# Altium schematic sheet [6] RGBLED.SchDoc: =DocumentName
size A3; ENG_APP_DATE: --/--/--; DSN_APP_DATE: --/--/--; CHK_APP_DATE: --/--/--; Organization: ORGANIZATION; Address1: R. Aprígio Veloso, 882, Universitário; Address2: Campina Grande - PB; Address3: 58429-900; DocumentNumber: 6; Revision: -; SheetNumber: 6; SheetTotal: 9; ENG_DATE: --/--/--; DSN_DATE: --/--/--; CHK_DATE: --/--/--; SCH_SCALE: 1:1
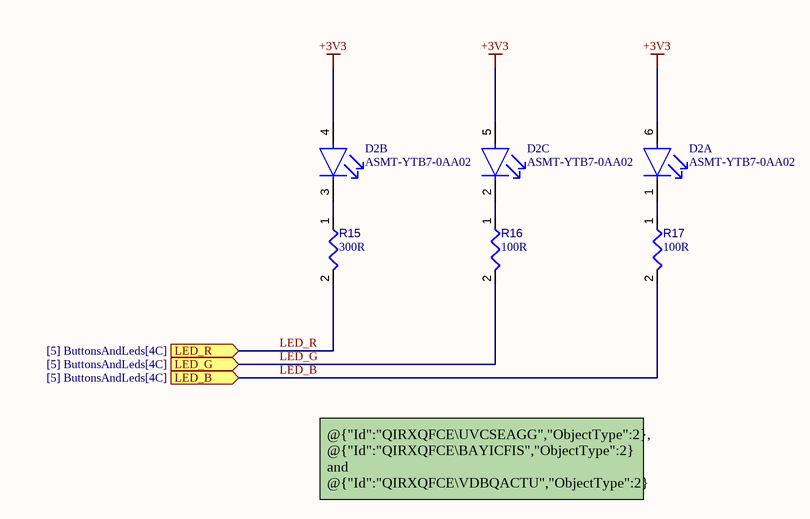
[diagram p0: [6] RGBLED.SchDoc]

## Parts
D2  ASMT-YTB7-0AA02  [FP-PLCC-6-MFG]  (parts A,B,C of 3)
R15  value 300R  [RESC0603(1608)_L]  (hidden comment: ERJ-3GEYJ301V)
R16  value 100R  [RESC0603(1608)_L]  (hidden comment: ERJ-3EKF1000V)
R17  value 100R  [RESC0603(1608)_L]  (hidden comment: ERJ-3EKF1000V)

## Ports
LED_B (in, see [5] ButtonsAndLeds[4C]), LED_G (in, see [5] ButtonsAndLeds[4C]), LED_R (in, see [5] ButtonsAndLeds[4C])

## Nets
+3V3: D2.4(Anode(Red)) D2.5(Anode(Green)) D2.6(Anode(Blue))
LED_B: R17.2 ; port LED_B
LED_G: R16.2 ; port LED_G
LED_R: R15.2 ; port LED_R
NetD2_1: D2.1(Cathode(Blue)) R17.1
NetD2_2: D2.2(Cathode(Green)) R16.1
NetD2_3: D2.3(Cathode(Red)) R15.1

## Notes on the sheet
- @{"Id":"QIRXQFCE\UVCSEAGG","ObjectType":2}, @{"Id":"QIRXQFCE\BAYICFIS","ObjectType":2} and @{"Id":"QIRXQFCE\VDBQACTU","ObjectType":2} calculated based on voltage drops for each LED for a same current amount of 10mA.
- REVISION
- DESCRIPTION
- DATE
- APPROVED
- ADDRESS
- PROJECT
- VERSION
- TITLE
- A3
- SIZE
- SCALE
- DOCUMENT NAME:
- DOCUMENT REVISION:
- OF
- SHEET:
- PROJECT REVISION:

## Library data of the parts
D2 = CMP-007-00036-1: LED Tri-Color Blue/Green/Red 469nm/529nm/623nm Chip LED 6-Pin PLCC T/R; Forward Voltage: 3.1V; Test Current: 20mA; Number of LEDs: 3; Lens Transparency: Diffused; Luminous Intensity: 384mcd; Viewing Angle: 120°; Color: Blue,Green,Red; Reverse Voltage: 4V; Dominant Wavelength: 469nm; Lens Style: Flat,Square,Diffused,Rectangular; Lens Size: 2.3mm; Packaging: Cut Tape; Min Operating Temperature: -40°C; Weight: 40mg; Forward Current: 20mA; Orientation: Top View; Package Quantity: 2000; Case/Package: PLCC; Length: 3mm; Height: 2mm; Max Operating Temperature: 100°C; Contact Plating: Silver; Width: 2.8mm; Reach SVHC Compliant: No; Pins: 6; Series: -; Mounting Technology: Surface Mount
R15 = CMP-009-00189-1: Res Thick Film 0603 300 Ohm 5% 1/10W ±200ppm/°C Molded SMD Punched Carrier T/R; Power Rating: 100mW; Voltage Rating (DC): 75V; Case Code (Metric): 1608; Termination: SMD/SMT; Series: ERJ; Package Quantity: 1; Case/Package: 0603; Reach SVHC Compliant: Unknown; Min Operating Temperature: -55°C; Contact Plating: Tin; Lead Free: Lead Free; Construction: Rectangular; Height: 0.45mm; Resistance Tolerance: 5%; Technology: THICK FILM; Width: 0.8mm; Max Operating Temperature: 155°C; Number of Terminations: 2; Case Code (Imperial): 0603; Pins: 2; Resistor Type: Thick Film; Voltage Rating: 75V; Length: 1.6mm; RoHS Compliant: Yes; Temperature Coefficient: 200ppm/°C; Features: Automotive AEC-Q200; Max Power Dissipation: 100mW; Military Standard: Not; Depth: 0.8mm; Weight: 7.1E-05oz; Tolerance: 5%; Radiation Hardening: No; Packaging: Tape and Reel; Mounting Technology: Surface Mount
R16 R17 = CMP-009-00188-1: SMD Chip Resistor, 100 Ohm, ï¿½ 1%, 100 mW, 0603 [1608 Metric], Thick Film, Precision; Max Power Dissipation: 100mW; Voltage Rating (DC): 75V; Temperature Coefficient: 100ppm/°C; Case Code (Metric): 1608; Radiation Hardening: No; Resistance Tolerance: 1%; Packaging: Tape and Reel; Contact Plating: Tin; Tolerance: 1%; RoHS Compliant: Yes; Termination: SMD/SMT; Resistor Type: Thick Film; Military Standard: Not; Series: ERJ; Mounting Technology: Surface Mount; Weight: 7.1E-05oz; Number of Terminations: 2; Case/Package: 0603; Package Quantity: 5000; Case Code (Imperial): 0603; Width: 0.8mm; Min Operating Temperature: -55°C; Max Operating Temperature: 155°C; Construction: Rectangular; Height: 0.45mm; Power Rating: 100mW; Length: 1.6mm; Lead Free: Lead Free; Voltage Rating: 75V; Reach SVHC Compliant: No; Features: Automotive AEC-Q200; Depth: 0.8mm